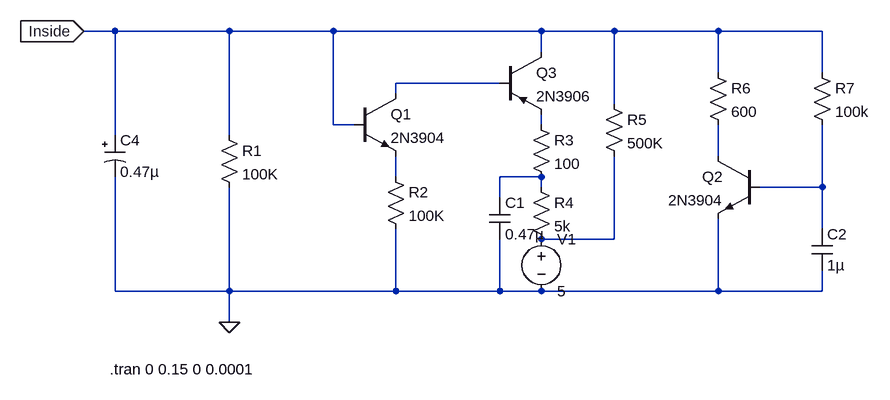
[diagram p0: schematic Maedo&MakinoNeuron.asc]
Maedo&MakinoNeuron.asc, the LTspice schematic file:
Version 4
SHEET 1 1132 680
WIRE -32 -80 -80 -80
WIRE 144 -80 -32 -80
WIRE 304 -80 144 -80
WIRE 624 -80 304 -80
WIRE 736 -80 624 -80
WIRE 896 -80 736 -80
WIRE 1056 -80 896 -80
WIRE 624 -48 624 -80
WIRE 896 -16 896 -80
WIRE 1056 -16 1056 -80
WIRE 560 0 400 0
WIRE 400 16 400 0
WIRE 736 32 736 -80
WIRE 304 64 304 -80
WIRE 336 64 304 64
WIRE 624 64 624 48
WIRE -32 80 -32 -80
WIRE 144 80 144 -80
WIRE 896 112 896 64
WIRE 400 144 400 112
WIRE 624 144 560 144
WIRE 624 160 624 144
WIRE 1056 160 1056 64
WIRE 1056 160 960 160
WIRE 560 176 560 144
WIRE 1056 224 1056 160
WIRE 736 240 736 112
WIRE 736 240 624 240
WIRE -32 320 -32 144
WIRE 144 320 144 160
WIRE 144 320 -32 320
WIRE 400 320 400 224
WIRE 400 320 144 320
WIRE 560 320 560 240
WIRE 560 320 400 320
WIRE 624 320 560 320
WIRE 896 320 896 208
WIRE 896 320 624 320
WIRE 1056 320 1056 288
WIRE 1056 320 896 320
WIRE 144 368 144 320
FLAG 144 368 0
FLAG -80 -80 Inside
IOPIN -80 -80 In
SYMBOL res 128 64 R0
SYMATTR InstName R1
SYMATTR Value 100K
SYMBOL npn 336 16 R0
SYMATTR InstName Q1
SYMATTR Value 2N3904
SYMBOL res 384 128 R0
SYMATTR InstName R2
SYMATTR Value 100K
SYMBOL pnp 560 -48 R0
SYMATTR InstName Q3
SYMATTR Value 2N3906
SYMBOL res 608 48 R0
SYMATTR InstName R3
SYMATTR Value 100
SYMBOL res 608 144 R0
SYMATTR InstName R4
SYMATTR Value 5k
SYMBOL cap 544 176 R0
SYMATTR InstName C1
SYMATTR Value 0.47µ
SYMBOL voltage 624 224 R0
SYMATTR InstName V1
SYMATTR Value 5
SYMBOL polcap -48 80 R0
SYMATTR InstName C4
SYMATTR Value 0.47µ
SYMBOL res 720 16 R0
SYMATTR InstName R5
SYMATTR Value 500K
SYMBOL res 880 -32 R0
SYMATTR InstName R6
SYMATTR Value 600
SYMBOL res 1040 -32 R0
SYMATTR InstName R7
SYMATTR Value 100k
SYMBOL npn 960 112 M0
SYMATTR InstName Q2
SYMATTR Value 2N3904
SYMBOL cap 1040 224 R0
SYMATTR InstName C2
SYMATTR Value 1µ
TEXT -40 440 Left 2 !.tran 0 0.15 0 0.0001

The netlist it stands for:
* Maedo&MakinoNeuron.asc
R1 Inside 0 100K
Q1 N001 Inside N004 0 2N3904
R2 N004 0 100K
Q3 Inside N001 N002 0 2N3906
R3 N002 N005 100
R4 N005 N007 5k
C1 N005 0 0.47µ
V1 N007 0 5
C4 Inside 0 0.47µ
R5 Inside N007 500K
R6 Inside N003 600
R7 Inside N006 100k
Q2 N003 N006 0 0 2N3904
C2 N006 0 1µ
.model NPN NPN
.model PNP PNP
.lib standard.bjt
.tran 0 0.15 0 0.0001
.backanno
.end